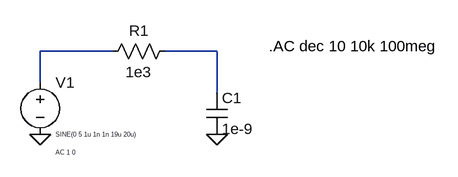
[diagram p0: schematic QUESTION6.asc]
QUESTION6.asc, the LTspice schematic file:
Version 4
SHEET 1 880 680
WIRE 16 160 -96 160
WIRE 176 160 96 160
WIRE -96 208 -96 160
WIRE 176 224 176 160
FLAG -96 288 0
FLAG 176 288 0
SYMBOL res 112 144 R90
WINDOW 0 0 56 VBottom 2
WINDOW 3 32 56 VTop 2
SYMATTR InstName R1
SYMATTR Value 1e3
SYMBOL cap 160 224 R0
SYMATTR InstName C1
SYMATTR Value 1e-9
SYMBOL voltage -96 192 R0
WINDOW 3 24 96 Left 0
WINDOW 123 24 124 Left 0
WINDOW 39 0 0 Left 0
SYMATTR InstName V1
SYMATTR Value SINE(0 5 1u 1n 1n 19u 20u)
SYMATTR Value2 AC 1 0
TEXT 256 152 Left 2 !.AC dec 10 10k 100meg

The netlist it stands for:
* QUESTION6.asc
R1 N002 N001 1e3
C1 N002 0 1e-9
V1 N001 0 SINE(0 5 1u 1n 1n 19u 20u) AC 1 0
.AC dec 10 10k 100meg
.backanno
.end